# EAGLE design ef9345 (EAGLE 9.6.2)
Assembly variants: NODIAG
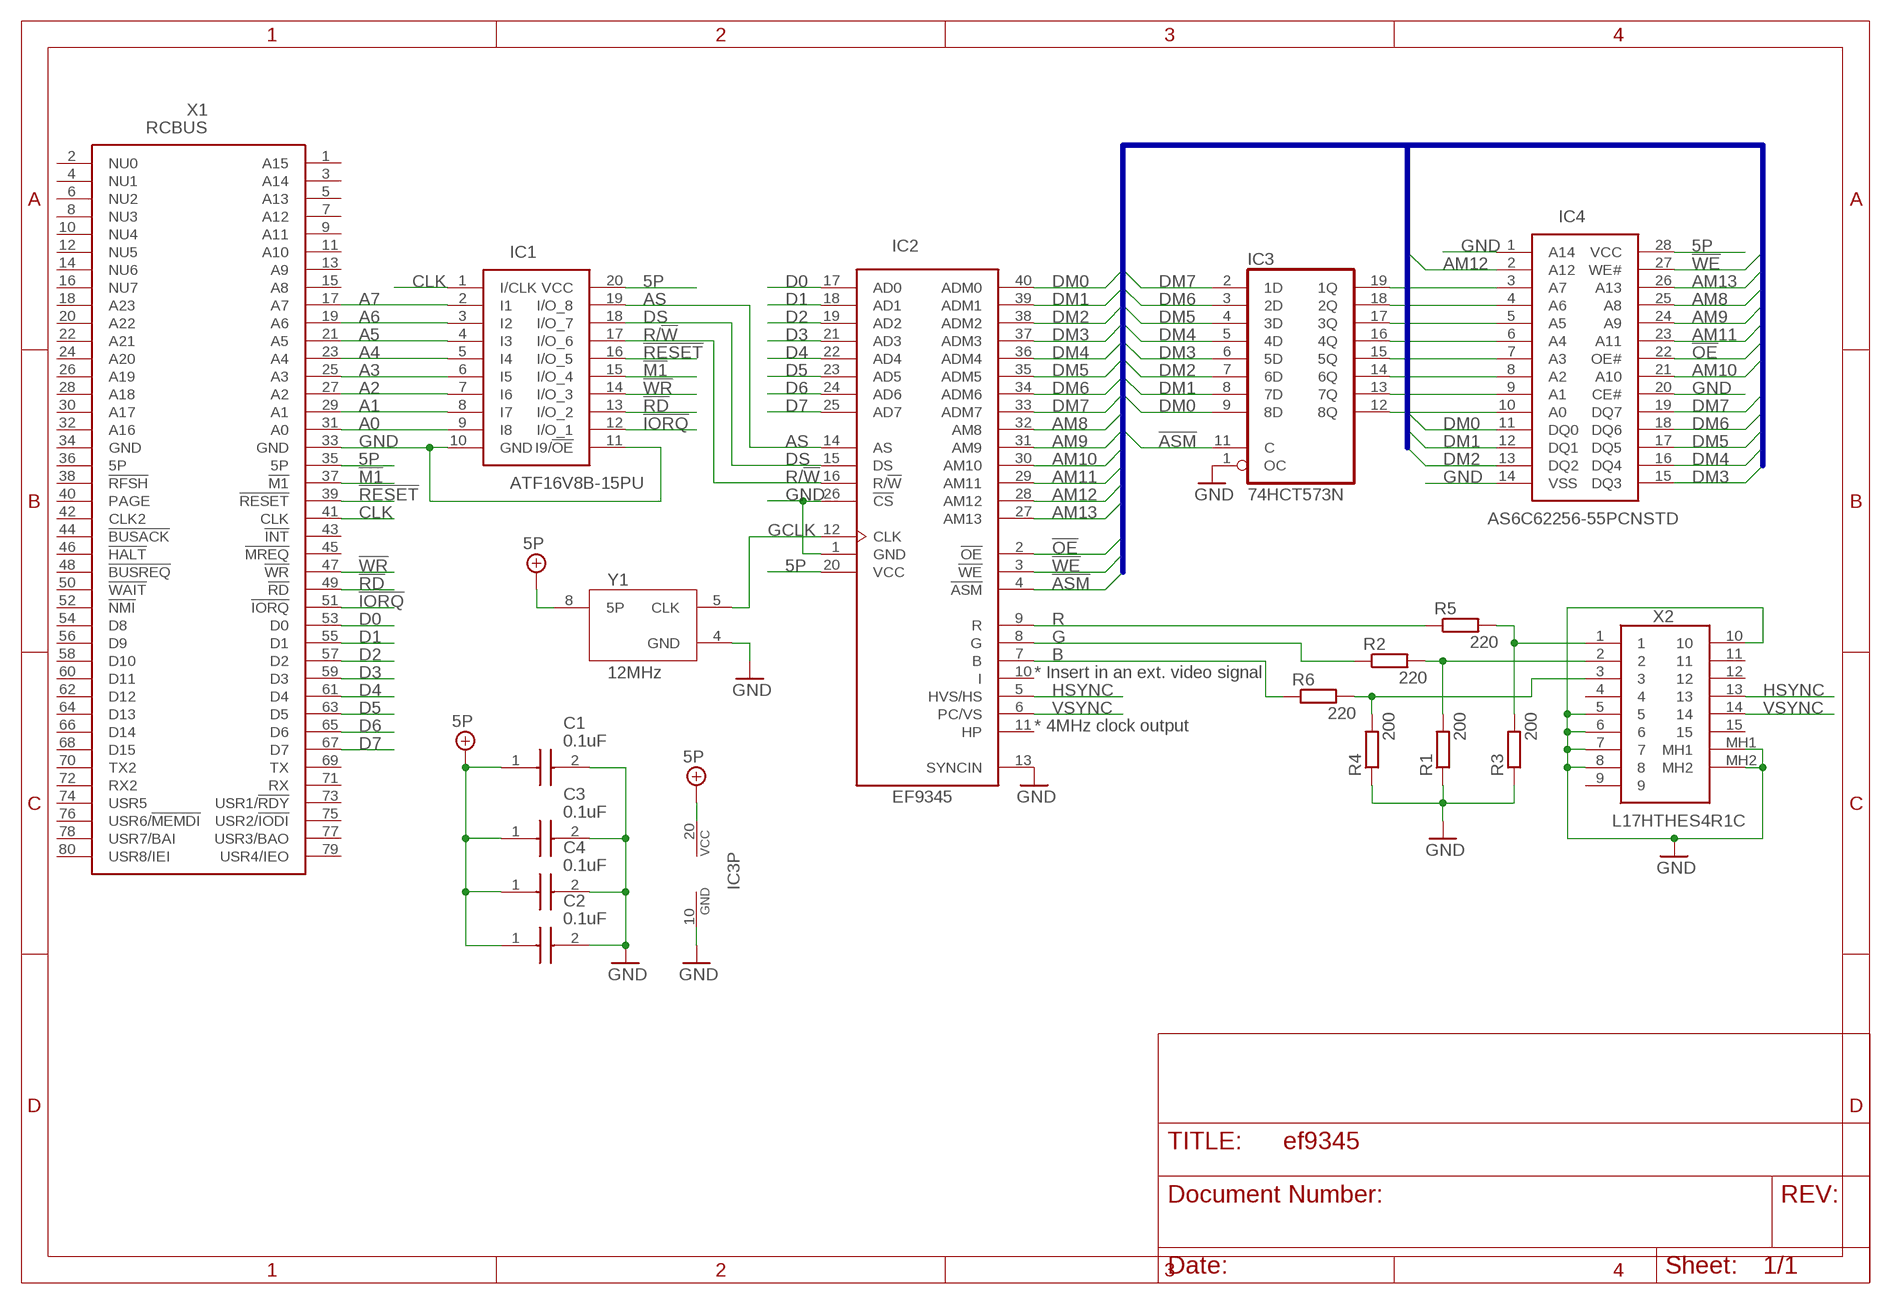
[diagram p0: schematic, sheet 1]

## Parts
C1  0.1uF  K104K15X7RF53H5  [K104K15X7RF53H5]
C2  0.1uF  K104K15X7RF53H5  [K104K15X7RF53H5]
C3  0.1uF  K104K15X7RF53H5  [K104K15X7RF53H5]
C4  0.1uF  K104K15X7RF53H5  [K104K15X7RF53H5]
IC1  ATF16V8B-15PU  [DIP794W59P254L2591H533Q20N]
IC2  EF9345  [DIL40]
IC3  74HCT573N  [DIL20]
IC4  AS6C62256-55PCNSTD  [DIL28]
R1  200  R_EU_020710  [0207/10]
R2  220  R_EU_020710  [0207/10]
R3  200  R_EU_020710  [0207/10]
R4  200  R_EU_020710  [0207/10]
R5  220  R_EU_020710  [0207/10]
R6  220  R_EU_020710  [0207/10]
X1  RCBUS  RCBUS_80_RA  [RC2014_80_RA]
X2  L17HTHES4R1C  [L17HTHES4R1C]
Y1  12MHz  ECS-2100AX-200  [ECS-2100AX-200]

## Nets
5P [pwr]: C1.1 C2.1 C3.1 C4.1 IC1.20(VCC) IC2.20(VCC) IC3.20(VCC) IC4.28(VCC) X1.35(5P) Y1.8(5P)
!ASM: IC2.4(!ASM) IC3.11(C)
!IORQ: IC1.12(I/O_1) X1.51(!IORQ)
!M1: IC1.15(I/O_4) X1.37(!M1)
!OE: IC2.2(!OE) IC4.22(OE#)
!RD: IC1.13(I/O_2) X1.49(!RD)
!RESET: IC1.16(I/O_5) X1.39(!RESET)
!WE: IC2.3(!WE) IC4.27(WE#)
!WR: IC1.14(I/O_3) X1.47(!WR)
A0: IC1.9(I8) X1.31(A0)
A1: IC1.8(I7) X1.29(A1)
A2: IC1.7(I6) X1.27(A2)
A3: IC1.6(I5) X1.25(A3)
A4: IC1.5(I4) X1.23(A4)
A5: IC1.4(I3) X1.21(A5)
A6: IC1.3(I2) X1.19(A6)
A7: IC1.2(I1) X1.17(A7)
AM8: IC2.32(AM8) IC4.25(A8)
AM9: IC2.31(AM9) IC4.24(A9)
AM10: IC2.30(AM10) IC4.21(A10)
AM11: IC2.29(AM11) IC4.23(A11)
AM12: IC2.28(AM12) IC4.2(A12)
AM13: IC2.27(AM13) IC4.26(A13)
AS: IC1.19(I/O_8) IC2.14(AS)
B: IC2.7(B) R6.1
CLK: IC1.1(I/CLK) X1.41(CLK)
D0: IC2.17(AD0) X1.53(D0)
D1: IC2.18(AD1) X1.55(D1)
D2: IC2.19(AD2) X1.57(D2)
D3: IC2.21(AD3) X1.59(D3)
D4: IC2.22(AD4) X1.61(D4)
D5: IC2.23(AD5) X1.63(D5)
D6: IC2.24(AD6) X1.65(D6)
D7: IC2.25(AD7) X1.67(D7)
DM0: IC2.40(ADM0) IC3.9(8D) IC4.11(DQ0)
DM1: IC2.39(ADM1) IC3.8(7D) IC4.12(DQ1)
DM2: IC2.38(ADM2) IC3.7(6D) IC4.13(DQ2)
DM3: IC2.37(ADM3) IC3.6(5D) IC4.15(DQ3)
DM4: IC2.36(ADM4) IC3.5(4D) IC4.16(DQ4)
DM5: IC2.35(ADM5) IC3.4(3D) IC4.17(DQ5)
DM6: IC2.34(ADM6) IC3.3(2D) IC4.18(DQ6)
DM7: IC2.33(ADM7) IC3.2(1D) IC4.19(DQ7)
DS: IC1.18(I/O_7) IC2.15(DS)
G: IC2.8(G) R2.1
GCLK: IC2.12(CLK) Y1.5(CLK)
GND [pwr]: C1.2 C2.2 C3.2 C4.2 IC1.10(GND) IC1.11(I9/!OE) IC2.1(GND) IC2.13(SYNCIN) IC2.26(!CS) IC3.1(OC) IC3.10(GND) IC4.1(A14) IC4.14(VSS) IC4.20(CE#) R1.1 R3.1 R4.1 X1.33(GND) X2.5 X2.6 X2.7 X2.8 X2.10 X2.MH1 X2.MH2 Y1.4(GND)
HSYNC: IC2.5(HVS/HS) X2.13
N$1: IC3.19(1Q) IC4.3(A7)
N$2: IC3.18(2Q) IC4.4(A6)
N$3: IC3.17(3Q) IC4.5(A5)
N$4: IC3.16(4Q) IC4.6(A4)
N$5: IC3.15(5Q) IC4.7(A3)
N$6: IC3.14(6Q) IC4.8(A2)
N$7: IC3.13(7Q) IC4.9(A1)
N$8: IC3.12(8Q) IC4.10(A0)
N$9: R3.2 R5.2 X2.1
N$10: R1.2 R2.2 X2.2
N$11: R4.2 R6.2 X2.3
R: IC2.9(R) R5.1
R/!W: IC1.17(I/O_6) IC2.16(R/!W)
VSYNC: IC2.6(PC/VS) X2.14
Unconnected: IC2.10(I) IC2.11(HP) X1.1(A15) X1.2(NU0) X1.3(A14) X1.4(NU1) X1.5(A13) X1.6(NU2) X1.7(A12) X1.8(NU3) X1.9(A11) X1.10(NU4) X1.11(A10) X1.12(NU5) X1.13(A9) X1.14(NU6) X1.15(A8) X1.16(NU7) X1.18(A23) X1.20(A22) X1.22(A21) X1.24(A20) X1.26(A19) X1.28(A18) X1.30(A17) X1.32(A16) X1.38(!RFSH) X1.40(PAGE) X1.42(CLK2) X1.43(!INT) X1.44(!BUSACK) X1.45(!MREQ) X1.46(!HALT) X1.48(!BUSREQ) X1.50(!WAIT) X1.52(!NMI) X1.54(D8) X1.56(D9) X1.58(D10) X1.60(D11) X1.62(D12) X1.64(D13) X1.66(D14) X1.68(D15) X1.69(TX) X1.70(TX2) X1.71(RX) X1.72(RX2) X1.73(USR1/!RDY) X1.74(USR5) X1.75(USR2/!IODI) X1.76(USR6/!MEMDI) X1.77(USR3/BAO) X1.78(USR7/BAI) X1.79(USR4/IEO) X1.80(USR8/IEI) X2.4 X2.9 X2.11 X2.12 X2.15

## Buses
5P,A0,A1,A2,A3,A4,A5,A6,A7,AM8,AM9,AM10,AM11,AM12,AM13,AS,!ASM,CLK,D0,D1,D2,D3,D4,D5,D6,D7,DM0,DM1,DM2,DM3,DM4,DM5,DM6,DM7,DS,GCLK,GND,!IORQ,!M1,N$1,N$2,N$3,N$4,N$5,N$6,N$7,N$8,!OE,!RD,!RESET,R/!W,!WE,!WR

## Notes on the sheet
- * Insert in an ext. video signal
- * 4MHz clock output

## Power pins joined to a net without a drawn wire
5P: X1.36(5P)
GND: X1.34(GND)

## Library data of the parts
C1-C4 = ef9345:K104K15X7RF53H5: Vishay 100nF Multilayer Ceramic Capacitor MLCC 50V dc +/-10% Through Hole K104K15X7RF53H5 Source: Datasheet <http://www.vishay.com/docs/45171/kseries.pdf>; ARROW_PART_NUMBER: K104K15X7RF53H5; ARROW_PRICE-STOCK: https://www.arrow.com/en/products/k104k15x7rf53h5/vishay?region=nac; DESCRIPTION: Vishay 100nF Multilayer Ceramic Capacitor MLCC 50V dc +/-10% Through Hole K104K15X7RF53H5; HEIGHT: mm; MANUFACTURER_NAME: Vishay; MANUFACTURER_PART_NUMBER: K104K15X7RF53H5; MOUSER_PART_NUMBER: 594-K104K15X7RF53H5; MOUSER_PRICE-STOCK: https://www.mouser.co.uk/ProductDetail/Vishay-BC-Components/K104K15X7RF53H5?qs=sYfpZ29HcUSlgH5bSUHkYw%3D%3D
IC1 = ef9345:ATF16V8B-15PU: Microchip Technology ATF16V8B-15PU, SPLD Simple Programmable Logic Device ATF16V8B 150 Gates, 8 Macro Cells, 8 I/O, Source: Datasheet <http://ww1.microchip.com/downloads/en/devicedoc/atmel-0364-pld-atf16v8b-8bq-8bql-datasheet.pdf>; ARROW_PART_NUMBER: ATF16V8B-15PU; ARROW_PRICE-STOCK: https://www.arrow.com/en/products/atf16v8b-15pu/microchip-technology; DESCRIPTION: Microchip Technology ATF16V8B-15PU, SPLD Simple Programmable Logic Device ATF16V8B 150 Gates, 8 Macro Cells, 8 I/O,; HEIGHT: 5.334mm; MANUFACTURER_NAME: Microchip; MANUFACTURER_PART_NUMBER: ATF16V8B-15PU; MOUSER_PART_NUMBER: 556-AF16V8B15PU; MOUSER_PRICE-STOCK: https://www.mouser.co.uk/ProductDetail/Microchip-Technology-Atmel/ATF16V8B-15PU?qs=2mdvTlUeTfCsdBIzx6v3gA%3D%3D
IC2 = ef9345:EF9345: Single Chip Semi-Graphic Display Processor EF9345
IC3 = ef9345:74*573: 8-bit D latch BUS DRIVER
IC4 = ef9345:AS6C62256-55PCN: Alliance Memory AS6C62256-55PCN SRAM Memory, 256kbit, 2.7 5.5 V, 55ns 28-Pin PDIP Source: Datasheet <https://componentsearchengine.com/Datasheets/1/AS6C62256-55PCN.pdf>; DESCRIPTION: Alliance Memory AS6C62256-55PCN SRAM Memory, 256kbit, 2.7 5.5 V, 55ns 28-Pin PDIP; HEIGHT: 3.81mm; MANUFACTURER_NAME: Alliance Memory; MANUFACTURER_PART_NUMBER: AS6C62256-55PCN; MOUSER_PART_NUMBER: 913-AS6C62256-55PCN; MOUSER_PRICE-STOCK: https://www.mouser.co.uk/ProductDetail/Alliance-Memory/AS6C62256-55PCN?qs=LD2UibpCYJqgbIupMJnGTQ%3D%3D
R1-R6 = ef9345:R_EU_0207: RESISTOR, European symbol; SPICEPREFIX: R
X1 = ef9345:RCBUS_80_RA: RC2014 extended bus 80 pin board connector
X2 = ef9345:L17HTHES4R1C: Dsub, Stamped Signal 3A, Right Angle PCB Thru Hole, Hight Temp High Density, FP=8.89mm (0.350in), 15 Socket, Bright Tin Shell, Flash Gold, 4-40 Rear Insert, Ground Tab&Boardlock, Plastic Tray, Close Back Source: Datasheet <https://cdn.amphenol-cs.com/media/wysiwyg/files/drawing/l17hthxs4rxc.p>; DESCRIPTION: Dsub, Stamped Signal 3A, Right Angle PCB Thru Hole, Hight Temp High Density, FP=8.89mm (0.350in), 15 Socket, Bright Tin Shell, Flash Gold, 4-40 Rear Insert, Ground Tab&Boardlock, Plastic Tray, Close Back; HEIGHT: 12.93mm; MANUFACTURER_NAME: Amphenol Communication Solutions; MANUFACTURER_PART_NUMBER: L17HTHES4R1C; MOUSER_PART_NUMBER: 523-L17HTHES4R1C; MOUSER_PRICE-STOCK: https://www.mouser.co.uk/ProductDetail/Amphenol-Commercial-Products/L17HTHES4R1C?qs=WHK%2FphiOHJaD15gkdKzsig%3D%3D
Y1 = ef9345:ECS-2100AX-200: XTAL OSC XO 20.0000MHZ HCMOS TTL Manufacturer's datasheet <https://ecsxtal.com/store/pdf/ecs-2100x.pdf>; CREATED_BY: PCBLayout.com; DIGIKEY_PART_NUMBER: X964-ND; MANUFACTURER: ECS Inc.; MPN: ECS-2100AX-200; PACKAGE: 8-DIP

## Net classes
0 default: width 0.381 mm
1 pwr: width 1.27 mm

## Board
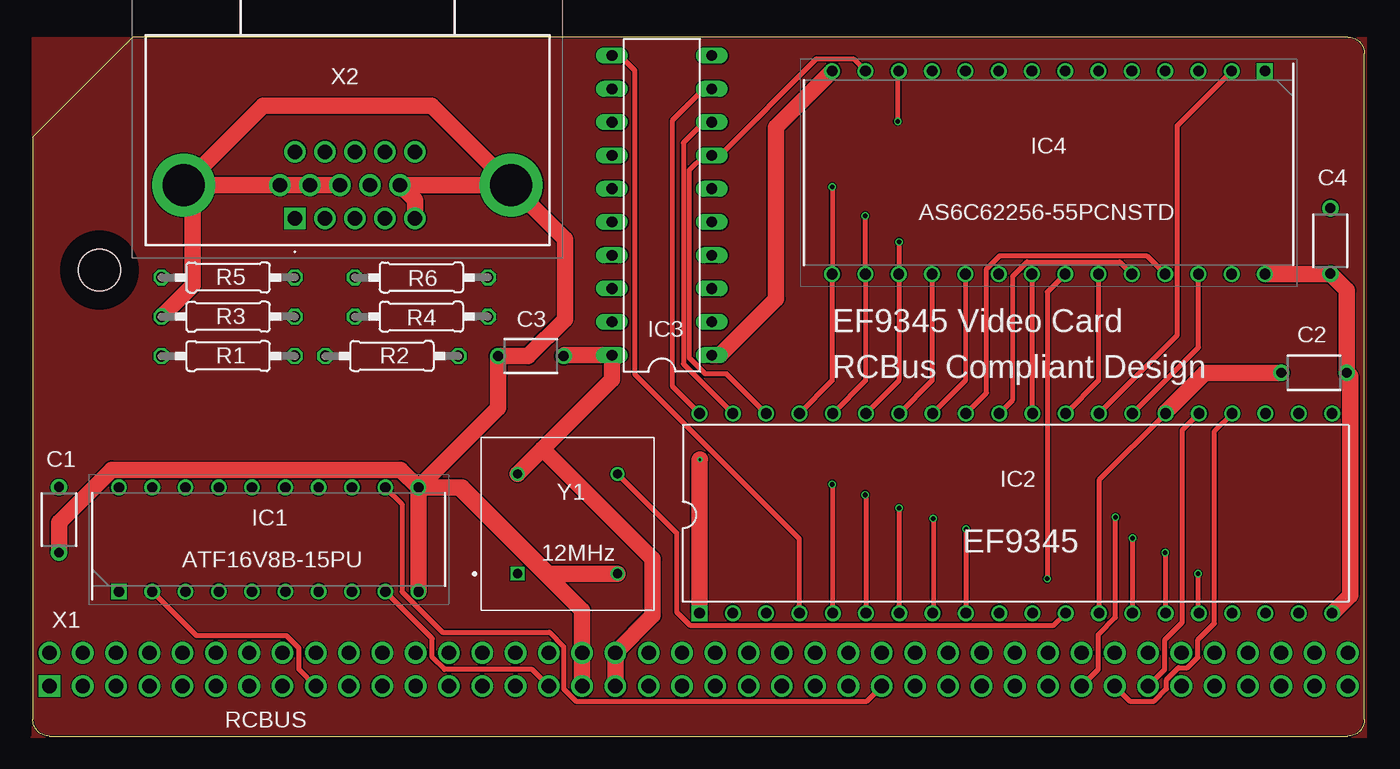
[diagram p1: board, top side]
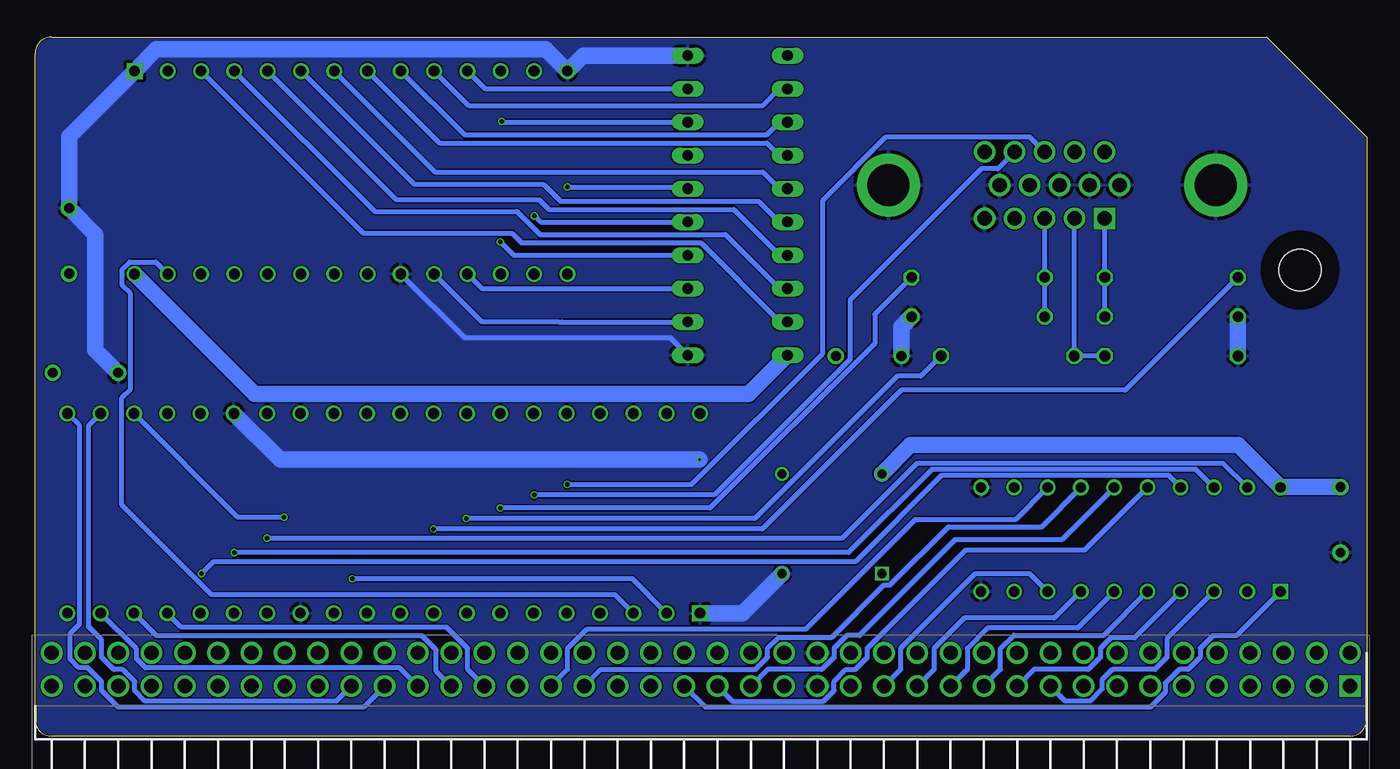
[diagram p2: board, bottom side, seen from below]

Size 101.6 x 53.34 mm. Coordinates in mm from the lower left corner, seen from the top.
Outline: 1.27,0 100.33,0 arc90 101.6,1.27 101.6,52.07 arc90 100.33,53.34 7.62,53.34 0,45.72 0,1.27 arc90 1.27,0
Copper layers (1*16): Top 0.035mm / dielectric 0.2mm / Bottom 0.035mm
Design rules "jlcpcb-2-layer": minimum track width 3.5mil, minimum drill 0.2mm, track to track 3.5mil, track to pad 5mil, pad to pad 5mil, via to via 5mil, smd to smd 0mil, copper to edge 0.1mm, drill to drill 5mil, minimum pad ring 4mil, minimum via ring 4mil, stop-mask expansion 3mil, vias tented up to drill 100mil, thermal gap 10mil
Holes 3.2 mm at 5.08,35.56
tRestrict: area 2.1,32.6 to 8.1,38.6
bRestrict: area 2.1,32.6 to 8.1,38.6

### Footprints (pad centres in the part's own frame; a part is rotated, then mirrored left to right if it is on the bottom)
K104K15X7RF53H5 = drill 0.75 pad 1.25: 1 -2.5,0; 2 2.5,0
DIP794W59P254L2591H533Q20N = drill 0.788 pad 1.188 square: 1 -3.969,11.43 | drill 0.788 pad 1.188: 2 -3.969,8.89; 3 -3.969,6.35; 4 -3.969,3.81; 5 -3.969,1.27; 6 -3.969,-1.27; 7 -3.969,-3.81; 8 -3.969,-6.35; 9 -3.969,-8.89; 10 -3.969,-11.43; 11 3.969,-11.43; 12 3.969,-8.89; 13 3.969,-6.35; 14 3.969,-3.81; 15 3.969,-1.27; 16 3.969,1.27; 17 3.969,3.81; 18 3.969,6.35; 19 3.969,8.89; 20 3.969,11.43
DIL40 = drill 0.813 square: 1 -24.13,-7.62 | drill 0.813: 2 -21.59,-7.62; 3 -19.05,-7.62; 4 -16.51,-7.62; 5 -13.97,-7.62; 6 -11.43,-7.62; 7 -8.89,-7.62; 8 -6.35,-7.62; 9 -3.81,-7.62; 10 -1.27,-7.62; 11 1.27,-7.62; 12 3.81,-7.62; 13 6.35,-7.62; 14 8.89,-7.62; 15 11.43,-7.62; 16 13.97,-7.62; 17 16.51,-7.62; 18 19.05,-7.62; 19 21.59,-7.62; 20 24.13,-7.62; 21 24.13,7.62; 22 21.59,7.62; 23 19.05,7.62; 24 16.51,7.62; 25 13.97,7.62; 26 11.43,7.62; 27 8.89,7.62; 28 6.35,7.62; 29 3.81,7.62; 30 1.27,7.62; 31 -1.27,7.62; 32 -3.81,7.62; 33 -6.35,7.62; 34 -8.89,7.62; 35 -11.43,7.62; 36 -13.97,7.62; 37 -16.51,7.62; 38 -19.05,7.62; 39 -21.59,7.62; 40 -24.13,7.62
DIL20 = drill 0.813 long: 1 -11.43,-3.81; 2 -8.89,-3.81; 3 -6.35,-3.81; 4 -3.81,-3.81; 5 -1.27,-3.81; 6 1.27,-3.81; 7 3.81,-3.81; 8 6.35,-3.81; 9 8.89,-3.81; 10 11.43,-3.81; 11 11.43,3.81; 12 8.89,3.81; 13 6.35,3.81; 14 3.81,3.81; 15 1.27,3.81; 16 -1.27,3.81; 17 -3.81,3.81; 18 -6.35,3.81; 19 -8.89,3.81; 20 -11.43,3.81
DIL28 = drill 0.813 square: 1 -7.748,16.51 | drill 0.813: 2 -7.748,13.97; 3 -7.748,11.43; 4 -7.748,8.89; 5 -7.748,6.35; 6 -7.748,3.81; 7 -7.748,1.27; 8 -7.748,-1.27; 9 -7.748,-3.81; 10 -7.748,-6.35; 11 -7.748,-8.89; 12 -7.748,-11.43; 13 -7.748,-13.97; 14 -7.748,-16.51; 15 7.748,-16.51; 16 7.748,-13.97; 17 7.748,-11.43; 18 7.748,-8.89; 19 7.748,-6.35; 20 7.748,-3.81; 21 7.748,-1.27; 22 7.748,1.27; 23 7.748,3.81; 24 7.748,6.35; 25 7.748,8.89; 26 7.748,11.43; 27 7.748,13.97; 28 7.748,16.51
0207/10 = drill 0.813 octagon: 1 -5.08,0; 2 5.08,0
RC2014_80_RA = drill 1.1 pad 1.65 square: 1 0,0 | drill 1.1 pad 1.65: 2 0,2.54; 3 2.54,0; 4 2.54,2.54; 5 5.08,0; 6 5.08,2.54; 7 7.62,0; 8 7.62,2.54; 9 10.16,0; 10 10.16,2.54; 11 12.7,0; 12 12.7,2.54; 13 15.24,0; 14 15.24,2.54; 15 17.78,0; 16 17.78,2.54; 17 20.32,0; 18 20.32,2.54; 19 22.86,0; 20 22.86,2.54; 21 25.4,0; 22 25.4,2.54; 23 27.94,0; 24 27.94,2.54; 25 30.48,0; 26 30.48,2.54; 27 33.02,0; 28 33.02,2.54; 29 35.56,0; 30 35.56,2.54; 31 38.1,0; 32 38.1,2.54; 33 40.64,0; 34 40.64,2.54; 35 43.18,0; 36 43.18,2.54; 37 45.72,0; 38 45.72,2.54; 39 48.26,0; 40 48.26,2.54; 41 50.8,0; 42 50.8,2.54; 43 53.34,0; 44 53.34,2.54; 45 55.88,0; 46 55.88,2.54; 47 58.42,0; 48 58.42,2.54; 49 60.96,0; 50 60.96,2.54; 51 63.5,0; 52 63.5,2.54; 53 66.04,0; 54 66.04,2.54; 55 68.58,0; 56 68.58,2.54; 57 71.12,0; 58 71.12,2.54; 59 73.66,0; 60 73.66,2.54; 61 76.2,0; 62 76.2,2.54; 63 78.74,0; 64 78.74,2.54; 65 81.28,0; 66 81.28,2.54; 67 83.82,0; 68 83.82,2.54; 69 86.36,0; 70 86.36,2.54; 71 88.9,0; 72 88.9,2.54; 73 91.44,0; 74 91.44,2.54; 75 93.98,0; 76 93.98,2.54; 77 96.52,0; 78 96.52,2.54; 79 99.06,0; 80 99.06,2.54
L17HTHES4R1C = drill 1.1 pad 1.65 square: 1 0,0 | drill 1.1 pad 1.65: 2 -2.29,0; 3 -4.58,0; 4 -6.87,0; 5 -9.16,0; 6 1.145,-2.54; 7 -1.145,-2.54; 8 -3.435,-2.54; 9 -5.725,-2.54; 10 -8.015,-2.54; 11 0,-5.08; 12 -2.29,-5.08; 13 -4.58,-5.08; 14 -6.87,-5.08; 15 -9.16,-5.08 | drill 3.2 pad 4.8: MH1 8.487,-2.54; MH2 -16.502,-2.54
ECS-2100AX-200 = drill 0.7 square: 1 -3.81,-3.81 | drill 0.7: 4 3.81,-3.81; 5 3.81,3.81; 8 -3.81,3.81

### Placement (x,y rotation side)
C1  2,16.5 270 top
C2  97.75,27.72 180 top
C3  38,29 180 top
C4  99,37.78 90 top
IC1  18,15 90 top
IC2  75,17 0 top
IC3  48,40.5 90 top
IC4  77.5,43 270 top
R1  14.9,29 0 top
R2  27.4,29 180 top
R3  14.9,32 0 top
R4  29.65,32 180 top
R5  14.9,35 0 top
R6  29.65,35 180 top
X1  1.27,3.81 0 top
X2  20,39.5 180 top
Y1  40.8,16.2 0 top

### Tracks (layer width: path | path; a pad name or v marks a point on that pad's centre or on a via)
5P
  Top 1.27: IC2.20 100.5,10.75 100.5,27.47 C2.1 100.25,34.03 C4.1 98.97,35.25 IC4.28 | X1.35 X1.36 47.3,9.2 47.3,13.5 38.89,21.91 | C3.1 40.57,29.07 IC3.20 44.19,27.21 38.89,21.91 | Y1.8 38.89,21.91
  Bottom 1.27: C1.1 6.54,19 IC1.20 9.8,22.2 34.8,22.2 Y1.8 | IC3.20 47.16,26.1 84.86,26.1 IC4.28
!ASM
  Top 0.381: IC2.4 58.49,15.05 45.94,27.61 45.94,50.79 44.8,51.93 IC3.11
!IORQ
  Top 0.381: IC1.12 28.16,17.7 28.16,11.01 31.25,7.92 39.42,7.92 40.51,6.82 40.51,3.59 41.44,2.67 63.63,2.67 X1.51
!M1
  Bottom 0.381: IC1.15 23.27,14.97 31.41,14.97 38.69,7.68 39.65,7.68 40.64,6.7 40.64,6 41.56,5.08 45.72,5.08 X1.37
!OE  (via drill 0.35)
  Top 0.381: IC4.22 77.4,33.88 v77.4,12
  Bottom 0.381: IC2.2 56.03,12 v77.4,12
!RD
  Bottom 0.381: X1.49 60.96,5.08 60.96,6.7 59.48,8.17 42.79,8.17 34.42,16.55 26.77,16.55 IC1.13
!RESET
  Bottom 0.381: X1.39 48.39,2.67 41.44,2.67 40.64,3.46 40.64,4.16 39.72,5.08 39.02,5.08 38.1,6 38.1,6.7 30.59,14.2 21.5,14.2 IC1.16
!WE
  Bottom 0.381: IC2.3 57.35,10.78 88.12,10.78 94.98,17.64 94.98,25.83 94.31,26.5 94.31,33.76 94.94,34.39 94.94,35.64 94.39,36.18 92.4,36.18 IC4.27
!WR
  Bottom 0.381: X1.47 58.42,5.08 46.64,5.08 45.7,6.02 45.7,6.71 44.87,7.55 40.81,7.55 36.84,11.52 36.36,11.52 31.9,15.98 24.8,15.98 IC1.14
A0
  Top 0.381: X1.31 38.1,5.08 31.4,5.08 30.48,6 30.48,7.44 IC1.9
A1
  Bottom 0.381: IC1.8 25.73,12.41 29.85,12.41 35.56,6.7 35.56,5.08 X1.29
A2
  Bottom 0.381: IC1.7 23.84,9 30.71,9 33.02,6.7 33.02,5.08 X1.27
A3
  Bottom 0.381: IC1.6 22.05,8.25 28.92,8.25 30.48,6.7 30.48,5.08 X1.25
A4
  Bottom 0.381: X1.23 27.94,5.08 27.94,6.7 26.93,7.7 20.06,7.7 IC1.5
A5
  Bottom 0.381: IC1.4 17.73,7.49 19.52,7.49 20.32,6.7 20.32,6 21.24,5.08 25.4,5.08 X1.21
A6
  Bottom 0.381: IC1.3 15.24,7.44 15.24,6 16.16,5.08 19.4,5.08 20.19,4.28 20.19,3.59 21.12,2.67 22.99,2.67 X1.19
A7
  Top 0.381: X1.17 20.32,5.08 20.32,6.7 19.36,7.65 12.49,7.65 IC1.2
AM8
  Top 0.381: IC2.32 72.76,26.19 72.76,35.64 73.78,36.65 84.99,36.65 IC4.25
AM9
  Top 0.381: IC2.31 74.76,25.65 74.76,35.09 75.85,36.18 82.92,36.18 IC4.24
AM10
  Top 0.381: IC4.21 76.23,24.66 IC2.30
AM11
  Top 0.381: IC4.23 81.31,27.12 IC2.29
AM12
  Top 0.381: IC2.28 87.32,30.59 87.32,46.59 IC4.2
AM13
  Top 0.381: IC2.27 88.93,29.66 IC4.26
AS  (via drill 0.35)
  Top 0.381: IC2.14 v83.9,15.1
  Bottom 0.381: IC1.19 10.96,20.82 34.31,20.82 40.03,15.1 v83.9,15.1
B  (via drill 0.35)
  Top 0.381: v66.1,17.4 IC2.7
  Bottom 0.381: R6.1 37.53,32.2 37.53,29.97 50.1,17.4 v66.1,17.4
CLK
  Bottom 0.381: IC1.1 9.95,7.65 11.74,7.65 12.7,6.7 12.7,6 13.62,5.08 14.32,5.08 15.37,4.03 15.37,3.34 16.51,2.2 50.46,2.2 X1.41
D0
  Bottom 0.381: X1.53 68.58,5.08 68.58,6.7 70.19,8.31 90.44,8.31 IC2.17
D1
  Bottom 0.381: X1.55 70.99,4.95 70.99,6.57 72.08,7.66 92.33,7.66 IC2.18
D2
  Bottom 0.381: X1.57 73.78,5.2 93.17,5.2 93.85,5.88 93.85,6.64 IC2.19
D3
  Bottom 0.381: X1.59 76.54,2.2 95.25,2.2 96.52,3.46 96.52,4.16 97.57,5.21 98.26,5.21 98.93,5.88 98.93,7.83 98.2,8.55 98.2,23.69 IC2.21
D4
  Bottom 0.381: X1.61 78.61,2.67 93.18,2.67 93.99,3.47 93.99,4.16 94.9,5.08 95.6,5.08 96.52,6 96.52,7.33 97.52,8.33 97.52,23.69 IC2.22
D5  (via drill 0.35)
  Top 0.381: X1.63 81.28,5.08 81.28,7.74 82.6,9.06 v82.6,16.7
  Bottom 0.381: v82.6,16.7 86.13,16.7 IC2.23
D6
  Top 0.381: X1.65 83.69,2.67 85.56,2.67 86.49,3.59 86.49,4.28 87.41,5.21 88.1,5.21 88.9,6 88.9,7.33 90.16,8.6 90.16,23.27 IC2.24
D7
  Top 0.381: X1.67 86.36,5.08 86.36,7.33 87.7,8.68 87.7,23.35 IC2.25
DM0
  Top 0.381: IC2.40 48.82,26.67 48.82,47.01 51.2,49.39 IC3.9
  Bottom 0.381: IC4.11 67.25,49.39 IC3.9
DM1  (via drill 0.35)
  Top 0.381: v66,46.9 66,50.68 IC4.12 | IC3.8 51.2,46.85 49.63,45.28 49.63,28.4 IC2.39
  Bottom 0.381: v66,46.9 65.95,46.85 IC3.8
DM2
  Top 0.381: IC2.38 52.94,27.64 51.32,27.64 50.1,28.86 50.1,43.21 51.2,44.31 IC3.7 52.42,44.31 59.78,51.67 62.6,51.67 IC4.13
DM3  (via drill 0.35)
  Top 0.381: v61,41.9 61,35.26 IC4.15 60.99,27.12 IC2.37
  Bottom 0.381: v61,41.9 52.55,41.9 52.42,41.77 IC3.6
DM4  (via drill 0.35)
  Top 0.381: v63.5,39.7 63.5,35.28 IC4.16 63.53,27.12 IC2.36
  Bottom 0.381: v63.5,39.7 63.03,39.23 52.42,39.23 IC3.5
DM5  (via drill 0.35)
  Top 0.381: IC2.35 66.07,27.12 IC4.17 66.07,37.67 v66.1,37.7
  Bottom 0.381: v66.1,37.7 65.09,36.69 52.42,36.69 IC3.4
DM6
  Top 0.381: IC4.18 68.61,27.12 IC2.34
  Bottom 0.381: IC4.18 67.51,34.15 52.42,34.15 IC3.3
DM7
  Top 0.381: IC4.19 71.15,27.12 IC2.33
  Bottom 0.381: IC3.2 61.4,31.61 61.66,31.61 67.51,31.61 IC4.19
DS  (via drill 0.35)
  Top 0.381: v86.4,14 86.4,9.41 IC2.15
  Bottom 0.381: IC1.18 13.03,20.35 33.18,20.35 39.53,14 v86.4,14
G  (via drill 0.35)
  Top 0.381: IC2.8 68.7,9.43 v68.7,16.6
  Bottom 0.381: v68.7,16.6 46.68,16.6 35.81,27.46 34.02,27.46 R2.1
GCLK
  Top 0.381: Y1.5 49.12,15.5 49.12,9.46 50.13,8.45 77.88,8.45 IC2.12
GND  (via drill 0.2)
  Top 0.381: IC2.26 81.35,19.54 IC2.13
  Top 1.27: X2.MH2 X2.10 29.16,40.9 X2.5 | X2.8 X2.7 X2.6 X2.MH1 | X1.33 X1.34 41.91,9.6 32.54,18.97 IC1.11 | Y1.4 39.34,12.39 32.76,18.97 IC1.11 | IC1.10 IC1.11 | C1.2 2,16.32 6.01,20.32 28.07,20.32 IC1.11 | IC1.11 35.5,25.04 C3.2 37.8,29 40.6,31.8 40.6,37.94 X2.MH2 | IC3.1 52.42,29.07 56.7,33.35 56.7,46.46 IC4.14 | C2.2 89.43,27.72 86.43,24.72 IC2.26 | X2.MH1 17.57,48.1 30.44,48.1 X2.MH2 | IC2.1 50.87,21.07 v50.9,21.1 | R3.1 12.2,34.38 12.2,41.35 X2.MH1
  Bottom 0.381: IC3.1 53.14,30.4 68.84,30.4 IC4.20
  Bottom 1.27: IC3.10 59.81,51.93 IC4.14 62.64,52.4 92.36,52.4 IC4.1 99,45.76 C4.2 97,38.28 97,29.47 C2.2 | v50.9,21.1 82.91,21.1 IC2.26 | IC2.1 47.62,9.38 Y1.4 | R1.1 R3.1 | C3.2 35.5,31.23 R4.1
  pour Bottom: -0.1,0 -0.1,53.4 101.7,53.4 101.7,-0.1 -0.1,-0.1
GNF
  pour Top: 0,0 0,53.3 101.7,53.3 101.7,-0.1 -0.1,-0.1
HSYNC  (via drill 0.35)
  Top 0.381: v61,19.2 61,9.41 IC2.5
  Bottom 0.381: X2.13 25.72,45.72 36.66,45.72 41.5,40.89 41.5,29.21 51.51,19.2 v61,19.2
N$1
  Bottom 0.381: IC4.3 76.56,38.38 65.22,38.38 64.48,37.64 50.81,37.64 44.8,31.63 44.8,31.61 IC3.19
N$2
  Bottom 0.381: IC4.4 75.67,40.02 64.83,40.02 63.08,38.28 48.93,38.28 44.8,34.15 IC3.18
N$3
  Bottom 0.381: IC4.5 74.03,40.93 63.14,40.93 62.39,40.18 48.29,40.18 44.8,36.69 IC3.17
N$4
  Bottom 0.381: IC4.6 72.68,42.12 62.81,42.12 61.51,40.82 46.39,40.82 44.8,39.23 IC3.16
N$5
  Bottom 0.381: IC4.7 71.06,43.04 46.07,43.04 44.8,41.77 IC3.15
N$6
  Bottom 0.381: IC4.8 70.74,45.26 45.75,45.26 44.8,44.31 IC3.14
N$7
  Bottom 0.381: IC4.9 68.84,45.9 45.75,45.9 44.8,46.85 IC3.13
N$8
  Bottom 0.381: IC4.10 68.52,48.12 46.07,48.12 44.8,49.39 IC3.12
N$9
  Bottom 0.381: X2.1 20,35.5 | 20,35.5 20,35.02 R5.2 | R3.2 19.98,35.48 20,35.5
N$10
  Bottom 0.381: X2.2 22.32,39.47 R2.2 R1.2
N$11
  Bottom 0.381: X2.3 R6.2 R4.2
R  (via drill 0.35)
  Top 0.381: IC2.9 v71.2,15.8
  Bottom 0.381: v71.2,15.8 46.1,15.8 35.5,26.4 18.42,26.4 R5.1
R/!W  (via drill 0.35)
  Top 0.381: IC2.16 88.9,9.45 v88.9,12.4
  Bottom 0.381: IC1.17 15.1,19.88 32.45,19.88 39.02,13.31 87.99,13.31 v88.9,12.4
VSYNC  (via drill 0.35)
  Top 0.381: v63.5,18.4 63.57,18.33 IC2.6
  Bottom 0.381: v63.5,18.4 49.77,18.4 39.41,28.75 39.41,33.28 29.4,43.3 28.15,43.3 X2.14

### Text on the board
tNames: EF9345 Video Card | RCBus Compliant Design